# EAGLE design Stackduino_v1.2_beta (EAGLE 6.5.0)
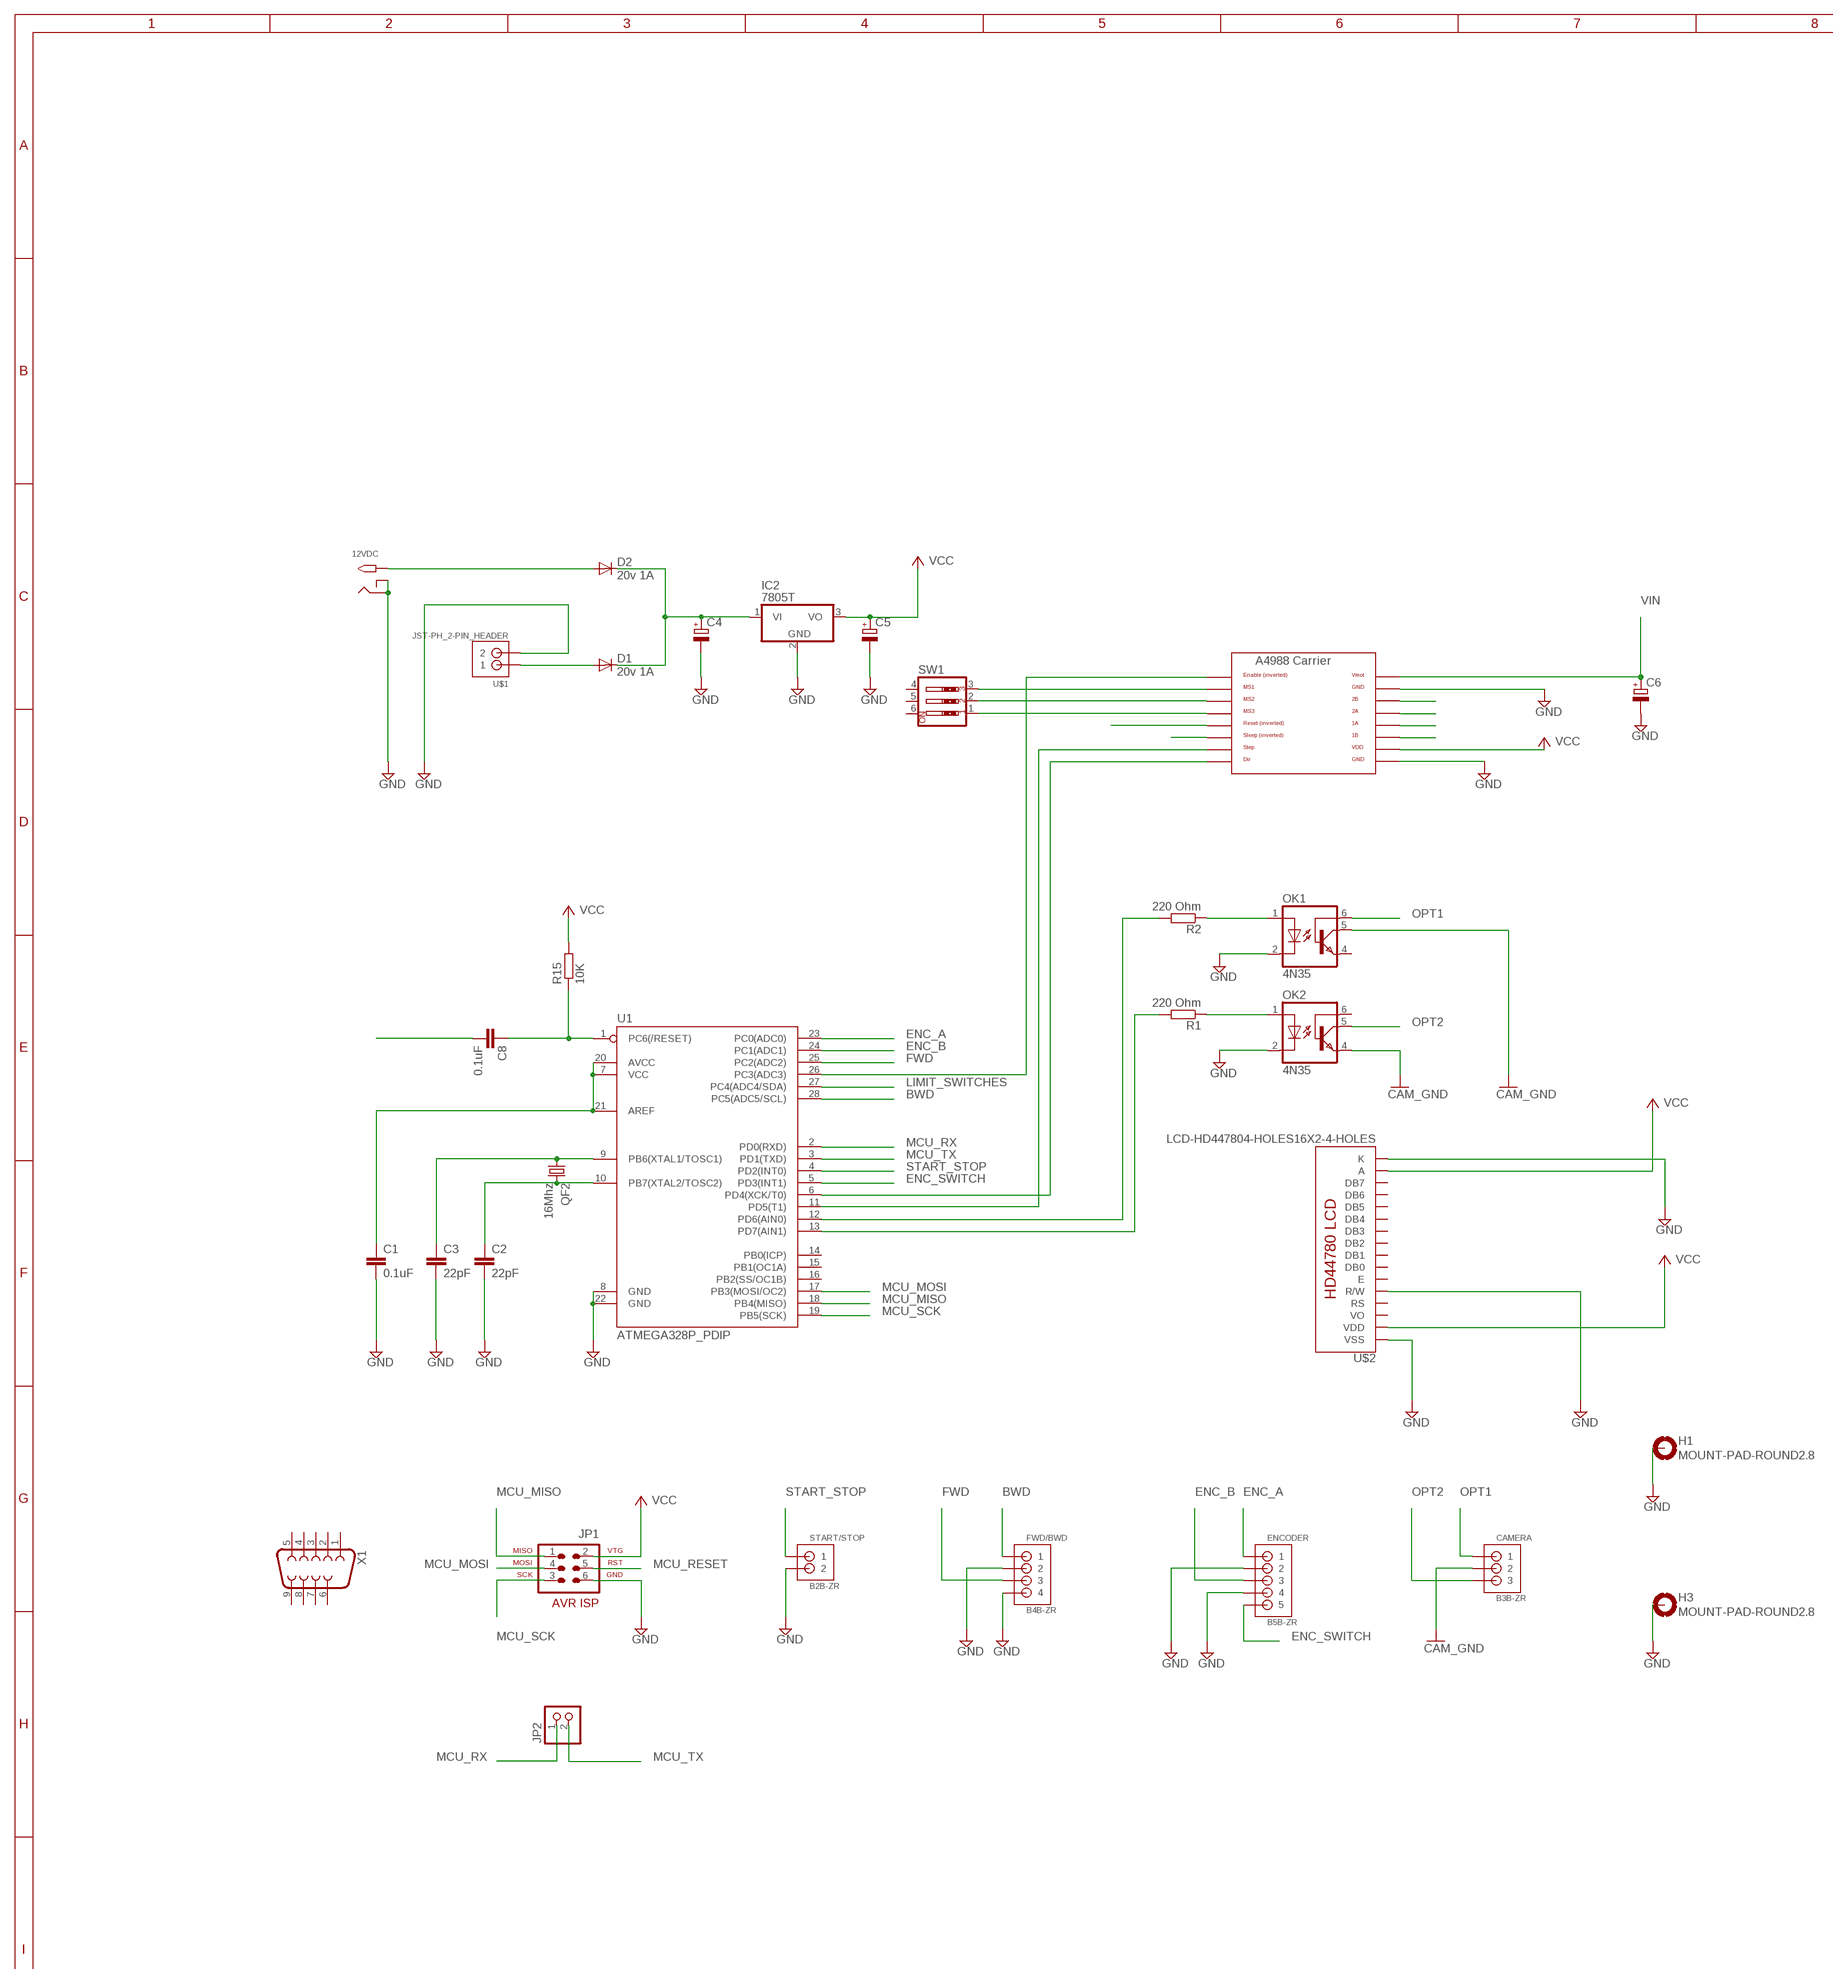
[diagram p0: schematic, sheet 1, part 1 of 2]
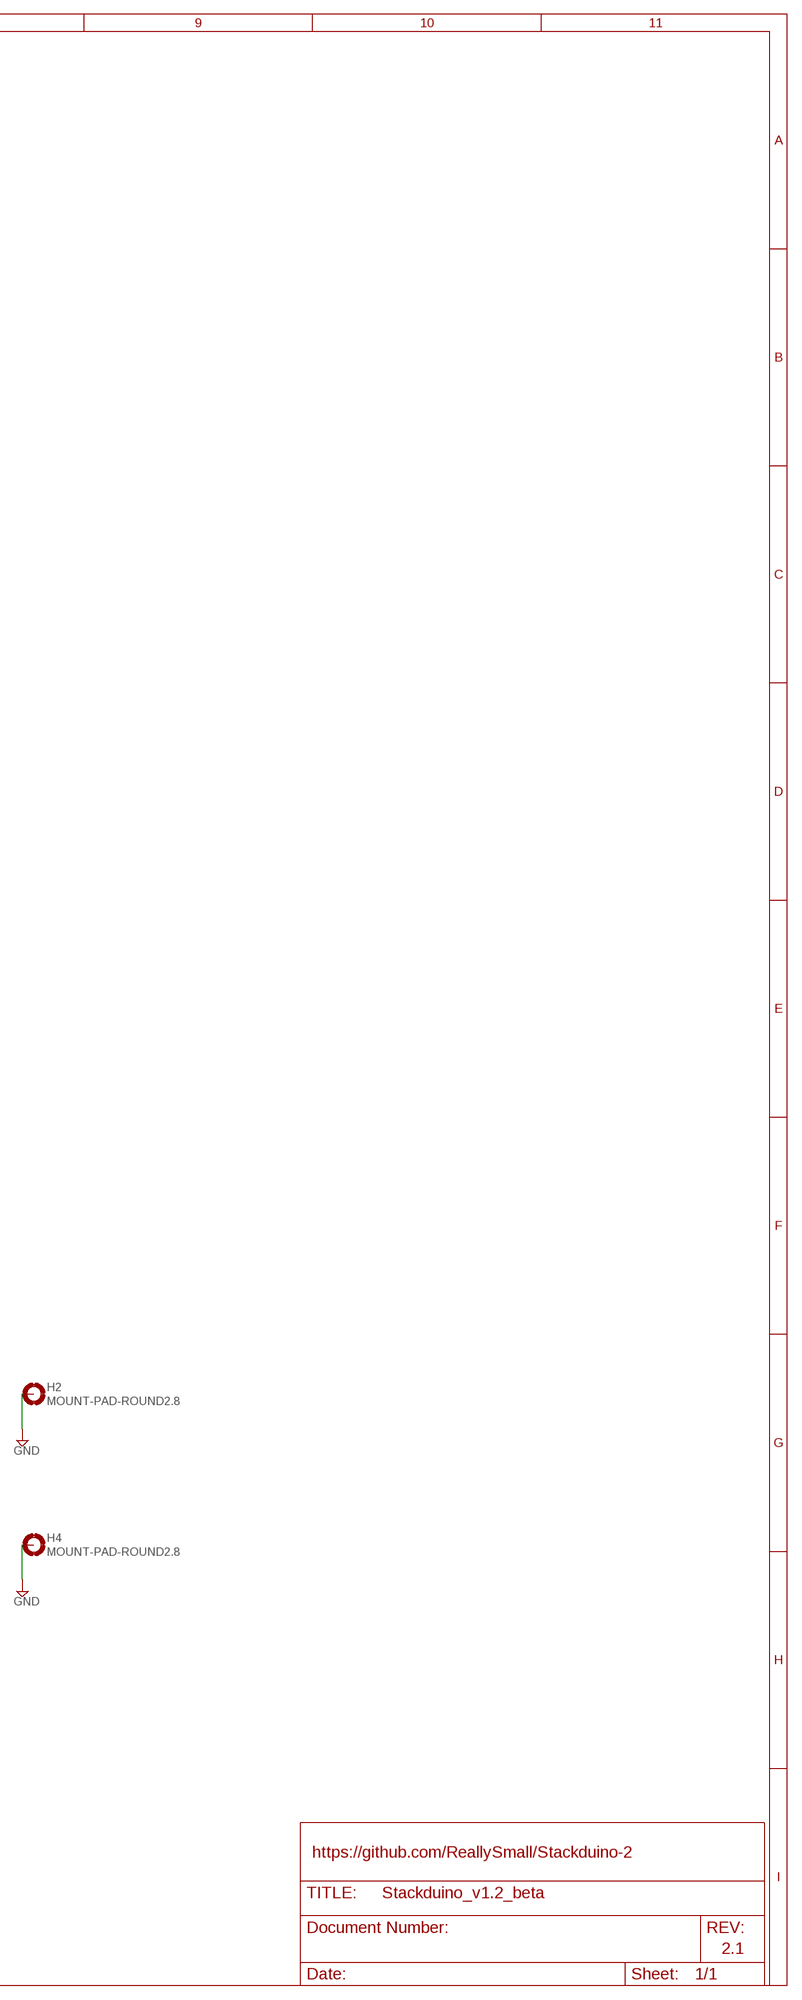
[diagram p1: schematic, sheet 1, part 2 of 2]

## Parts
12VDC  2.1MMJACKTHM  [PJ-102A]
A4988_CARRIER  A4988BREAKOUT  [A4988BREAKOUT]
C1  0.1uF  C-EU025-030X050  [C025-030X050]
C2  22pF  C-EU025-030X050  [C025-030X050]
C3  22pF  C-EU025-030X050  [C025-030X050]
C4  CPOL-EUSANYO_C  [SANYO-OSCON_C]
C5  CPOL-EUSANYO_C  [SANYO-OSCON_C]
C6  CPOL-EUSANYO_C  [SANYO-OSCON_C]
C8  0.1uF  C-EU025-030X050  [C025-030X050]
CAMERA  B3B-ZR  [B3B-ZR]
D1  20v 1A  1N4933  [DO41-10]
D2  20v 1A  1N4933  [DO41-10]
ENCODER  B5B-ZR  [B5B-ZR]
FWD/BWD  B4B-ZR  [B4B-ZR]
H1  MOUNT-PAD-ROUND2.8  [2,8-PAD]
H2  MOUNT-PAD-ROUND2.8  [2,8-PAD]
H3  MOUNT-PAD-ROUND2.8  [2,8-PAD]
H4  MOUNT-PAD-ROUND2.8  [2,8-PAD]
IC2  7805T  [TO220H]
JP1  AVR-5_AVR-ISP-6  [AVR-5_AVR-ISP-6]
JP2  PINHD-1X2  [1X02]
OK1  4N35  [DIL06]
OK2  4N35  [DIL06]
QF2  16Mhz  CRYSTALHC49U-V  [HC49U-V]
R1  220 Ohm  R-EU_0207/10  [0207/10]
R2  220 Ohm  R-EU_0207/10  [0207/10]
R15  10K  R-EU_0207/10  [0207/10]
START/STOP  B2B-ZR  [B2B-ZR]
SW1  SW_DIP-3  [EDG-03]
U1  ATMEGA328P_PDIP  [DIL28-3]
U$1  JST-PH_2-PIN_HEADER  [JST_B2B-PH_HEADER]
U$2  LCD-HD447804-HOLES16X2-4-HOLES  [LCD-16X2-4HOLES]
X1  F09H  [F09H]

## Nets
BWD: FWD/BWD.1 U1.28(PC5(ADC5/SCL))
CAM_GND: CAMERA.2 OK1.5(COL) OK2.4(EMI)
DIR: A4988_CARRIER.DIR U1.6(PD4(XCK/T0))
ENABLE: A4988_CARRIER.EN U1.26(PC3(ADC3))
ENC_A: ENCODER.1 U1.23(PC0(ADC0))
ENC_B: ENCODER.3 U1.24(PC1(ADC1))
ENC_SWITCH: ENCODER.5 U1.5(PD3(INT1))
FWD: FWD/BWD.3 U1.25(PC2(ADC2))
GND: 12VDC.RING 12VDC.RING_SW A4988_CARRIER.GND A4988_CARRIER.GND@0(GND) C1.2 C2.2 C3.2 C4.- C5.- C6.- ENCODER.2 ENCODER.4 FWD/BWD.2 FWD/BWD.4 H1.B2,8(MOUNT) H2.B2,8(MOUNT) H3.B2,8(MOUNT) H4.B2,8(MOUNT) IC2.2(GND) JP1.6 OK1.2(C) OK2.2(C) START/STOP.2 U1.8(GND) U1.22(GND) U$1.P2 U$2.1(VSS) U$2.5(R/W) U$2.16(K)
LIMIT_SWITCHES: U1.27(PC4(ADC4/SDA))
MCU_MISO: JP1.1 U1.18(PB4(MISO))
MCU_MOSI: JP1.4 U1.17(PB3(MOSI/OC2))
MCU_RESET: C8.1 JP1.5 R15.1 U1.1(PC6(/RESET))
MCU_RX: JP2.1 U1.2(PD0(RXD))
MCU_SCK: JP1.3 U1.19(PB5(SCK))
MCU_TX: JP2.2 U1.3(PD1(TXD))
MS1: A4988_CARRIER.MS1 SW1.3
MS2: A4988_CARRIER.MS2 SW1.2
MS3: A4988_CARRIER.MS3 SW1.1
N$1: D1.A U$1.P1
N$2: C1.1 U1.7(VCC) U1.20(AVCC) U1.21(AREF)
N$3: R1.2
N$4: 12VDC.TIP D2.A
N$5: C2.1 QF2.2 U1.10(PB7(XTAL2/TOSC2))
N$6: C3.1 QF2.1 U1.9(PB6(XTAL1/TOSC1))
N$10: C8.2
N$11: R2.2
N$13: A4988_CARRIER.RST
N$34: OK1.1(A) R2.1
N$36: OK2.1(A) R1.1
OPT1: CAMERA.1 OK1.6(BAS)
OPT2: CAMERA.3 OK2.5(COL)
OUT1A: A4988_CARRIER.1B
OUT1B: A4988_CARRIER.1A
OUT2A: A4988_CARRIER.2A
OUT2B: A4988_CARRIER.2B
SLEEP: A4988_CARRIER.SLP(SLEEP)
START_STOP: START/STOP.1 U1.4(PD2(INT0))
STEP: A4988_CARRIER.STEP U1.11(PD5(T1))
VCC: A4988_CARRIER.VDD C5.+ IC2.3(VO) JP1.2 R15.2 U$2.2(VDD) U$2.15(A)
VIN: A4988_CARRIER.VMOT C4.+ C6.+ D1.C D2.C IC2.1(VI)
Unconnected: OK1.4(EMI) OK2.6(BAS) SW1.4 SW1.5 SW1.6 U1.12(PD6(AIN0)) U1.13(PD7(AIN1)) U1.14(PB0(ICP)) U1.15(PB1(OC1A)) U1.16(PB2(SS/OC1B)) U$2.3(VO) U$2.4(RS) U$2.6(E) U$2.7(DB0) U$2.8(DB1) U$2.9(DB2) U$2.10(DB3) U$2.11(DB4) U$2.12(DB5) U$2.13(DB6) U$2.14(DB7) X1.1 X1.2 X1.3 X1.4 X1.5 X1.6 X1.7 X1.8 X1.9

## Notes on the sheet
- https://github.com/ReallySmall/Stackduino-2
- 2.1

## Library data of the parts
12VDC = adafruit:2.1MMJACK: 2.1mm x 5.5mm THM DC jack with internal switch. Digikey part #PJ-102A, 4UCON part #05537 2.1mm x 5.5mm SMT DC jack with internal switch. Digikey part #PJ-002A-SMT, 4UCON part #03267 By microbuilder.eu & adafruit.com
A4988_CARRIER = RepRapjr:A4988BREAKOUT
C1-C3 C8 = rcl:C-EU: CAPACITOR, European symbol
C4-C6 = rcl:CPOL-EU: POLARIZED CAPACITOR, European symbol
CAMERA = jst-connectors:B3B-ZR: JST-ZH Connector 3 pol, 1.5mm pitch Package: B3B-ZR Source: http://www.jst-mfg.com/product/pdf/eng/eZH.pdf
D1 D2 = diode:1N4933: DIODE fast recovery rectifier, 1A
ENCODER = jst-connectors:B5B-ZR: JST-ZH Connector 5 pol, 1.5mm pitch Package: B5B-ZR Source: http://www.jst-mfg.com/product/pdf/eng/eZH.pdf
FWD/BWD = jst-connectors:B4B-ZR: JST-ZH Connector 4 pol, 1.5mm pitch Package: B4B-ZR Source: http://www.jst-mfg.com/product/pdf/eng/eZH.pdf
H1-H4 = holes:MOUNT-PAD-ROUND: MOUNTING PAD, round
IC2 = linear:78*: Positive VOLTAGE REGULATOR Source: http://cache.national.com/ds/LM/LM78L05.pdf http://www.fairchildsemi.com/ds/LM/LM7805.pdf
JP1 = Stackduino-SMD:AVR-5_AVR-ISP-6: AVR ISP-6 Serial Programming Header
JP2 = pinhead:PINHD-1X2: PIN HEADER
OK1 OK2 = optocoupler:4N35: MOTOROLA OPTO COUPLER; MF: FAIRCHILD SEMICONDUCTOR; MPN: 4N35; OC_FARNELL: 1328375; OC_NEWARK: 72K9946
QF2 = crystal:CRYSTAL: CRYSTAL; OC_FARNELL: 1666969; OC_NEWARK: unknown
R1 R2 R15 = rcl:R-EU_: RESISTOR, European symbol
START/STOP = jst-connectors:B2B-ZR: JST-ZH Connector 2 pol, 1.5mm pitch Package: B2B-ZR
SW1 = special:SW_DIP-3: DIP SWITCH
U1 = SparkFun-DigitalIC:ATMEGA328P_PDIP: uC used in the Arduino 32kb flash, 1k EEPROM, 2k SRAM This is the through-hole version of this chip.
U$1 = SRG:JST-PH_2-PIN_HEADER: 2-pin JST PH Shrouded Header, top entry P/N B2B-PH-K-S Mating connector PHR-2 Mating cable assembly: Sparkfun PRT-09914 <http://www.sparkfun.com/products/9914>
U$2 = HD44780LCD:LCD-HD44780
X1 = con-subd:F09: SUB-D; OC_FARNELL: unknown; OC_NEWARK: unknown

## Board
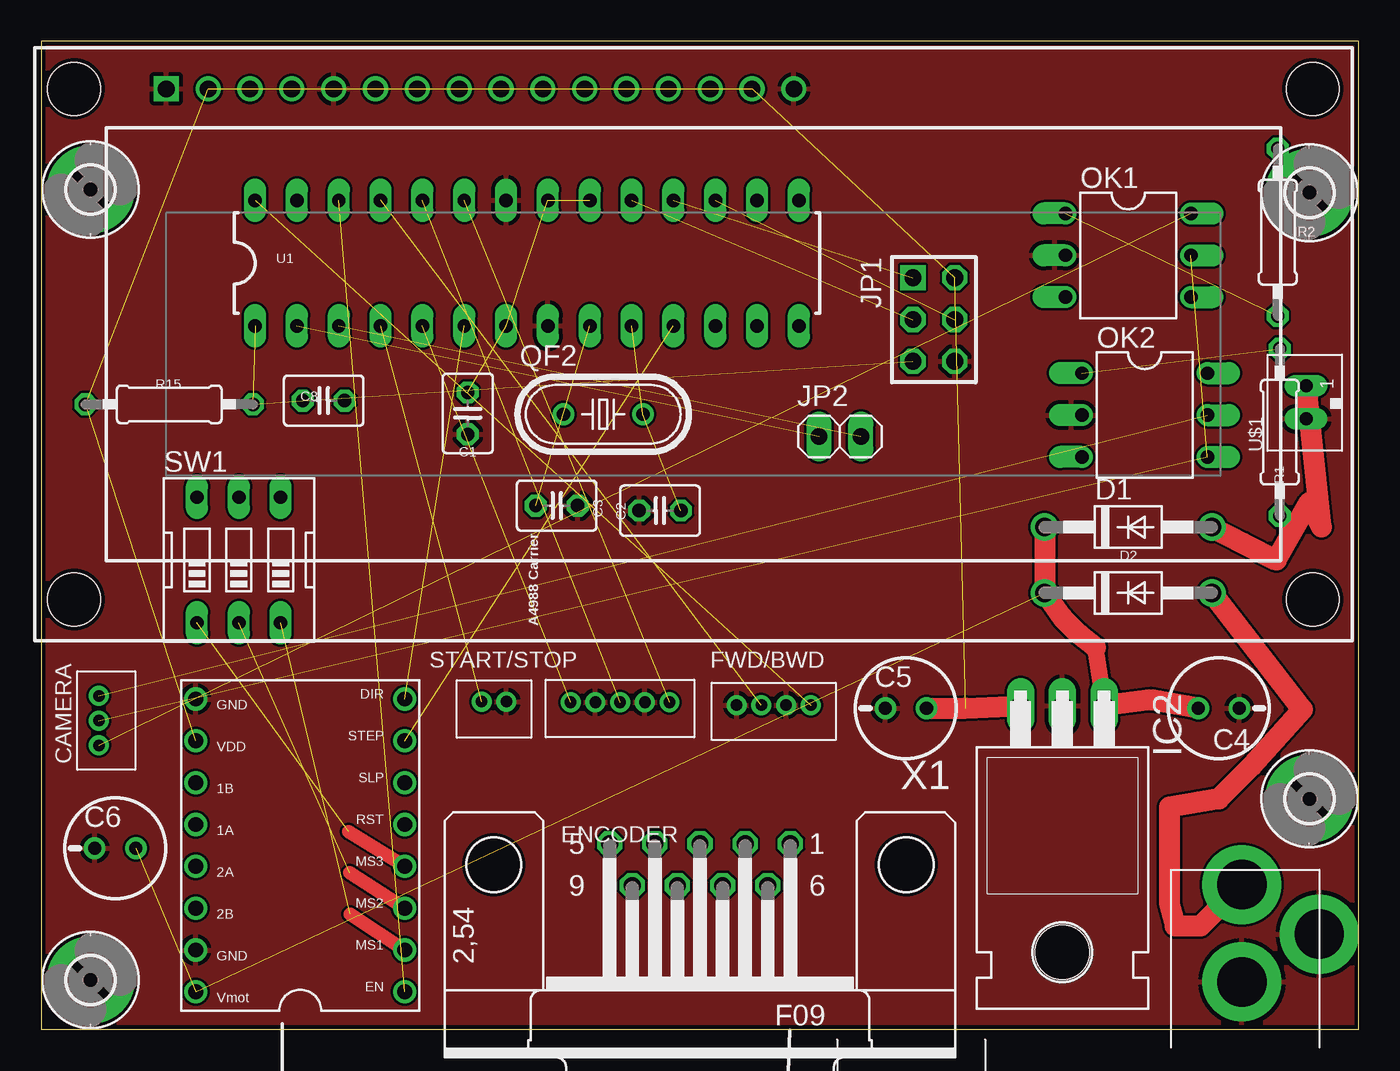
[diagram p2: board, top side]
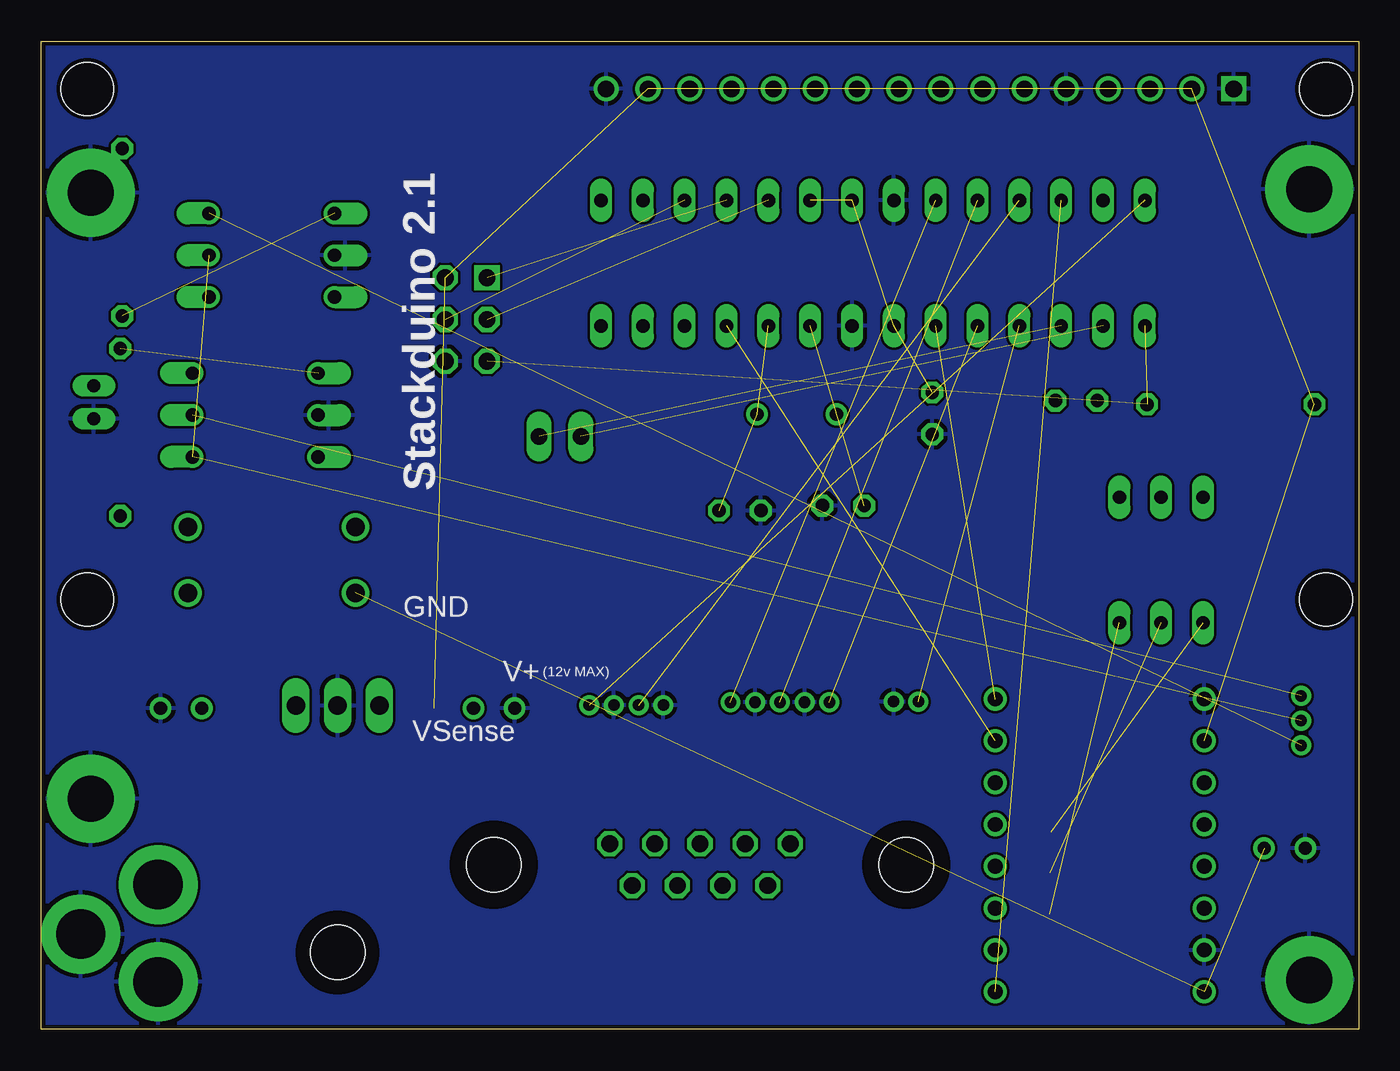
[diagram p3: board, bottom side, seen from below]

Size 80 x 60 mm. Coordinates in mm from the lower left corner, seen from the top.
Outline: 80,0 80,60 0,60 0,0 80,0
Copper layers (1*16): Top 0.035mm / dielectric 1.5mm / Bottom 0.035mm
Design rules "SeeedStudio_DRU_no_angle_2layer": minimum track width 6mil, minimum drill 12mil, track to track 6mil, track to pad 6mil, pad to pad 6mil, via to via 6mil, smd to smd 0mil, copper to edge 10mil, drill to drill 10mil, minimum pad ring 10mil, minimum via ring 6mil, stop-mask expansion 2mil, vias tented up to drill 25mil, thermal gap 10mil

### Footprints (pad centres in the part's own frame; a part is rotated, then mirrored left to right if it is on the bottom)
PJ-102A = drill 3 pad 4.8: RING 0.1,-3.39; RING_SW -4.6,-6.29; TIP 0.1,-9.29
A4988BREAKOUT = drill 0.9: 1A 8.89,1.27; 1B 11.43,1.27; 2A 6.35,1.27; 2B 3.81,1.27; DIR 16.51,-11.43; EN -1.27,-11.43; GND 16.51,1.27; GND@0 1.27,1.27; MS1 1.27,-11.43; MS2 3.81,-11.43; MS3 6.35,-11.43; RST 8.89,-11.43; SLP 11.43,-11.43; STEP 13.97,-11.43; VDD 13.97,1.27; VMOT -1.27,1.27
C025-030X050 = drill 0.813 octagon: 1 -1.27,0; 2 1.27,0
SANYO-OSCON_C = drill 0.8 pad 1.27: + 1.25,0; - -1.25,0
B3B-ZR = drill 0.7 pad 1.1: 1 -1.5,0; 2 0,0; 3 1.5,0
DO41-10 = drill 1.118: A 5.08,0; C -5.08,0
B5B-ZR = drill 0.7: 1 3,0.013; 2 1.5,0.013; 3 0,0.013; 4 -1.5,0.013; 5 -3,0.013
B4B-ZR = drill 0.7: 1 6,-1.3; 2 4.5,-1.3; 3 3,-1.3; 4 1.5,-1.3
2,8-PAD = drill 2.8 pad 5.334: B2,8 0,0
TO220H = drill 1.118 long: 1 -2.54,-10.16; 2 0,-10.16; 3 2.54,-10.16 | hole 3.302: 0,4.826
AVR-5_AVR-ISP-6 = drill 1.016 square: 1 -2.54,-1.27 | drill 1.016 octagon: 2 -2.54,1.27; 3 0,-1.27; 4 0,1.27; 5 2.54,-1.27; 6 2.54,1.27
1X02 = drill 1.016 long: 1 -1.27,0; 2 1.27,0
DIL06 = drill 0.813 offset: 1 -2.54,-3.81; 2 0,-3.81; 3 2.54,-3.81; 4 2.54,3.81; 5 0,3.81; 6 -2.54,3.81
HC49U-V = drill 0.813: 1 -2.413,0; 2 2.413,0
0207/10 = drill 0.813 octagon: 1 -5.08,0; 2 5.08,0
B2B-ZR = drill 0.7 pad 1.1: 1 0.92,-0.75; 2 2.42,-0.75
EDG-03 = drill 0.813 long: 1 -2.54,-3.81; 2 0,-3.81; 3 2.54,-3.81; 4 2.54,3.81; 5 0,3.81; 6 -2.54,3.81
DIL28-3 = drill 0.813 long: 1 -16.51,-3.81; 2 -13.97,-3.81; 3 -11.43,-3.81; 4 -8.89,-3.81; 5 -6.35,-3.81; 6 -3.81,-3.81; 7 -1.27,-3.81; 8 1.27,-3.81; 9 3.81,-3.81; 10 6.35,-3.81; 11 8.89,-3.81; 12 11.43,-3.81; 13 13.97,-3.81; 14 16.51,-3.81; 15 16.51,3.81; 16 13.97,3.81; 17 11.43,3.81; 18 8.89,3.81; 19 6.35,3.81; 20 3.81,3.81; 21 1.27,3.81; 22 -1.27,3.81; 23 -3.81,3.81; 24 -6.35,3.81; 25 -8.89,3.81; 26 -11.43,3.81; 27 -13.97,3.81; 28 -16.51,3.81
JST_B2B-PH_HEADER = drill 0.8 long: P1 1.075,0.048; P2 -0.925,0.048
LCD-16X2-4HOLES = drill 1.016 square: 1 -32,15.5 | drill 1.016: 2 -29.46,15.5; 3 -26.92,15.5; 4 -24.38,15.5; 5 -21.84,15.5; 6 -19.3,15.5; 7 -16.76,15.5; 8 -14.22,15.5; 9 -11.68,15.5; 10 -9.14,15.5; 11 -6.6,15.5; 12 -4.06,15.5; 13 -1.52,15.5; 14 1.02,15.5; 15 3.56,15.5; 16 6.1,15.5 | hole 3.2: -37.6,15.5; -37.6,-15.5; 37.6,-15.5; 37.6,15.5
F09H = drill 1.016 octagon: 1 -5.486,-1.27; 2 -2.743,-1.27; 3 0,-1.27; 4 2.743,-1.27; 5 5.486,-1.27; 6 -4.115,1.27; 7 -1.372,1.27; 8 1.372,1.27; 9 4.115,1.27 | hole 3.302: -12.522,0; 12.522,0

### Placement (x,y rotation side)
12VDC  73,-0.5 180 top
A4988_CARRIER  10.65,3.55 90 top
C1  25.9,37.4 270 top
C2  37.58,31.5 180 top
C3  31.3,31.8 0 top
C4  71.5,19.5 180 top
C5  52.5,19.5 0 top
C6  4.5,11 0 top
C8  17.15,38.17 0 top
CAMERA  3.5,18.75 90 top
D1  66,30.5 0 top
D2  66,26.5 0 top
ENCODER  35.15,19.85 0 top
FWD/BWD  40.73,20.99 0 top
H1  3,51 180 top
H2  77,50.8 180 top
H3  3,3 180 top
H4  77,14 180 top
IC2  62,9.5 180 top
JP1  54.2,43.1 270 top
JP2  48.5,36 0 top
OK1  66,47 270 top
OK2  67,37.3 270 top
QF2  34.12,37.35 0 top
R1  75.2,36.26 270 top
R2  75.08,48.4 90 top
R15  7.78,37.95 180 top
START/STOP  25.82,20.65 0 top
SW1  12,28.5 0 top
U1  29.5,46.52 0 top
U$1  76.85,38 90 top
U$2  39.6,41.6 0 top
X1  40,10 180 top

### Tracks (layer width: path | path; a pad name or v marks a point on that pad's centre or on a via)
BWD  (1 unrouted)
CAM_GND  (2 unrouted)
DIR  (1 unrouted)
ENABLE  (1 unrouted)
ENC_A  (1 unrouted)
ENC_B  (1 unrouted)
ENC_SWITCH  (1 unrouted)
FWD  (1 unrouted)
GND
  pour Top (rank 2): -1.23,61.42 56,61.03 arc-90 88.53,55.12 88.53,0.54 arc-90 55.99,-4.74 3.55,-4.47 arc-90 -1.06,1.28
  pour Bottom: 88.2,60.15 88.85,-3 arc-90 57.23,-3.9 1.57,-3.9 arc-90 -1.23,7.5 -1.55,61.55
MCU_MISO  (1 unrouted)
MCU_MOSI  (1 unrouted)
MCU_RESET  (3 unrouted)
MCU_RX  (1 unrouted)
MCU_SCK  (1 unrouted)
MCU_TX  (1 unrouted)
MS1  (1 unrouted)
  Top 0.813: 18.76,7 A4988_CARRIER.MS1
MS2  (1 unrouted)
  Top 0.813: 18.72,9.5 A4988_CARRIER.MS2
MS3  (1 unrouted)
  Top 0.813: 18.68,12 A4988_CARRIER.MS3
N$1
  Top 1.27: D1.A 73,29.5 75,28.5 77,32 77.73,30.5 U$1.P1
N$2  (3 unrouted)
N$4
  Top 1.27: D2.A 76.58,19.42 73.5,16 71.5,14 68.5,13.5 68.5,7.63 68.85,6.28 70.39,6.28 12VDC.TIP
N$5  (2 unrouted)
N$6  (2 unrouted)
N$34  (1 unrouted)
N$36  (1 unrouted)
OPT1  (1 unrouted)
OPT2  (1 unrouted)
START_STOP  (1 unrouted)
STEP  (1 unrouted)
VCC  (5 unrouted)
  Top 1.27: C5.+ 56.12,19.5 IC2.3
VIN  (2 unrouted)
  Top 1.016: 64,23.2 IC2.1
  Top 1.27: C4.+ 67.38,20 IC2.1 | D1.C D2.C 62,25 63,24 64,23.2

### Text on the board
tPlace: A4988 Carrier
bPlace: Stackduino 2.1
bNames: GND | (12v MAX) | V+ | VSense